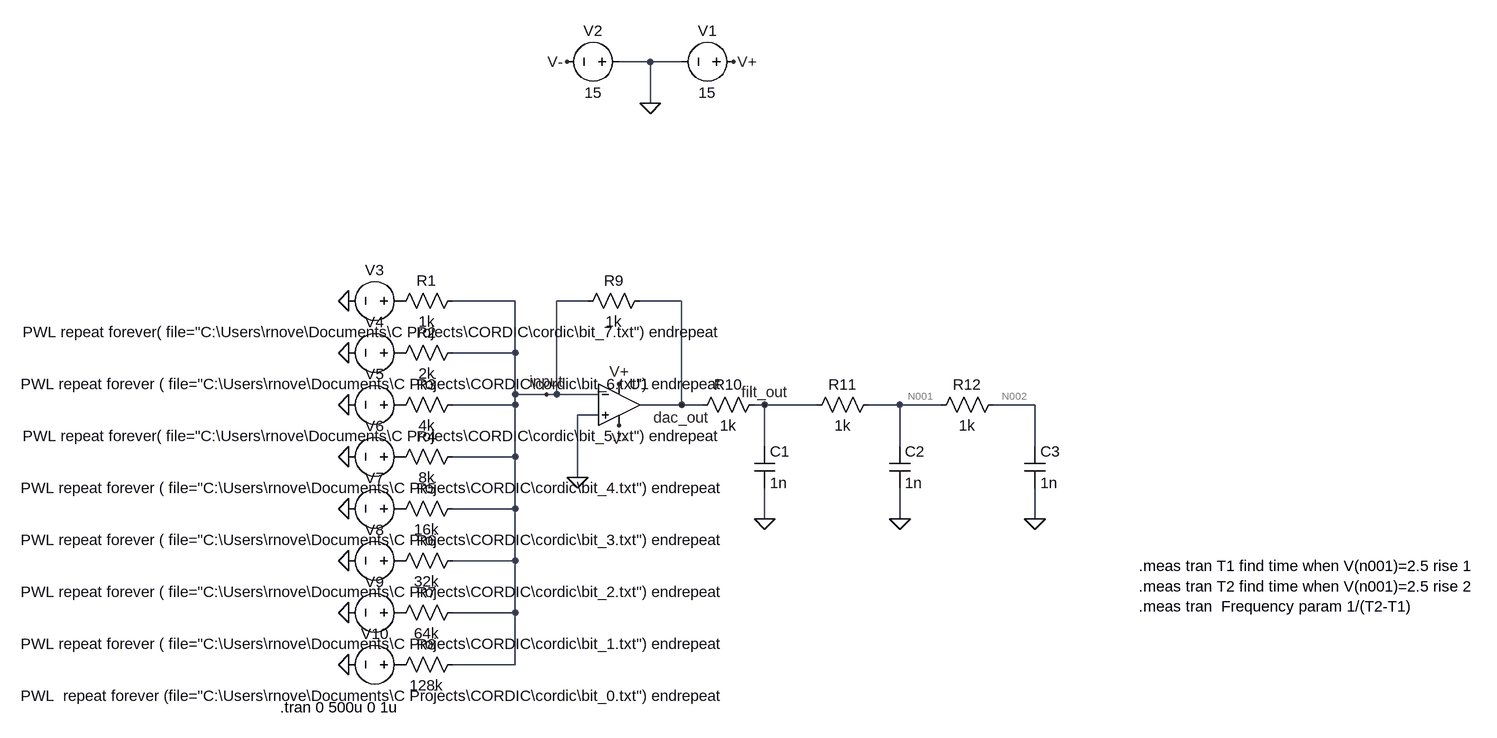
[diagram p0: schematic cordic_dac.asc]
cordic_dac.asc, the LTspice schematic file:
Version 4
SHEET 1 1596 680
WIRE 272 -352 224 -352
WIRE 320 -352 272 -352
WIRE 272 -288 272 -352
WIRE 64 16 -32 16
WIRE 176 16 128 16
WIRE 320 16 256 16
WIRE 64 96 64 16
WIRE 64 96 -32 96
WIRE 64 160 64 96
WIRE 112 160 64 160
WIRE 128 160 128 16
WIRE 128 160 112 160
WIRE 192 160 128 160
WIRE 64 176 64 160
WIRE 64 176 -32 176
WIRE 320 176 320 16
WIRE 320 176 256 176
WIRE 352 176 320 176
WIRE 448 176 432 176
WIRE 528 176 448 176
WIRE 656 176 608 176
WIRE 720 176 656 176
WIRE 864 176 800 176
WIRE 192 192 160 192
WIRE 448 240 448 176
WIRE 656 240 656 176
WIRE 864 240 864 176
WIRE 64 256 64 176
WIRE 64 256 -32 256
WIRE 160 288 160 192
WIRE 64 336 64 256
WIRE 64 336 -32 336
WIRE 448 352 448 304
WIRE 656 352 656 304
WIRE 864 352 864 304
WIRE 64 416 64 336
WIRE 64 416 -32 416
WIRE 64 496 64 416
WIRE 64 496 -32 496
WIRE 64 576 64 496
WIRE 64 576 -32 576
FLAG 224 144 V+
FLAG 224 208 V-
FLAG 160 288 0
FLAG 272 -288 0
FLAG 400 -352 V+
FLAG 144 -352 V-
FLAG 448 352 0
FLAG -192 576 0
FLAG -192 496 0
FLAG -192 416 0
FLAG -192 336 0
FLAG -192 256 0
FLAG -192 176 0
FLAG -192 96 0
FLAG -192 16 0
FLAG 112 160 input
FLAG 320 176 dac_out
FLAG 448 176 filt_out
FLAG 656 352 0
FLAG 864 352 0
SYMBOL OpAmps\\UniversalOpAmp2 224 176 R0
SYMATTR InstName U1
SYMATTR SpiceLine Ilimit=25m Rail=50 Vos=0
SYMBOL res -16 0 R90
WINDOW 0 0 56 VBottom 2
WINDOW 3 32 56 VTop 2
SYMATTR InstName R1
SYMATTR Value 1k
SYMBOL res -16 80 R90
WINDOW 0 0 56 VBottom 2
WINDOW 3 32 56 VTop 2
SYMATTR InstName R2
SYMATTR Value 2k
SYMBOL res -16 160 R90
WINDOW 0 0 56 VBottom 2
WINDOW 3 32 56 VTop 2
SYMATTR InstName R3
SYMATTR Value 4k
SYMBOL res -16 240 R90
WINDOW 0 0 56 VBottom 2
WINDOW 3 32 56 VTop 2
SYMATTR InstName R4
SYMATTR Value 8k
SYMBOL res -16 320 R90
WINDOW 0 0 56 VBottom 2
WINDOW 3 32 56 VTop 2
SYMATTR InstName R5
SYMATTR Value 16k
SYMBOL res -16 400 R90
WINDOW 0 0 56 VBottom 2
WINDOW 3 32 56 VTop 2
SYMATTR InstName R6
SYMATTR Value 32k
SYMBOL res -16 480 R90
WINDOW 0 0 56 VBottom 2
WINDOW 3 32 56 VTop 2
SYMATTR InstName R7
SYMATTR Value 64k
SYMBOL res -16 560 R90
WINDOW 0 0 56 VBottom 2
WINDOW 3 32 56 VTop 2
SYMATTR InstName R8
SYMATTR Value 128k
SYMBOL voltage 416 -352 R90
WINDOW 0 -32 56 VBottom 2
WINDOW 3 32 56 VTop 2
WINDOW 123 0 0 Left 0
WINDOW 39 0 0 Left 0
SYMATTR InstName V1
SYMATTR Value 15
SYMBOL voltage 240 -352 R90
WINDOW 0 -32 56 VBottom 2
WINDOW 3 32 56 VTop 2
WINDOW 123 0 0 Left 0
WINDOW 39 0 0 Left 0
SYMATTR InstName V2
SYMATTR Value 15
SYMBOL res 272 0 R90
WINDOW 0 0 56 VBottom 2
WINDOW 3 32 56 VTop 2
SYMATTR InstName R9
SYMATTR Value 1k
SYMBOL cap 432 240 R0
SYMATTR InstName C1
SYMATTR Value 1n
SYMBOL res 448 160 R90
WINDOW 0 0 56 VBottom 2
WINDOW 3 32 56 VTop 2
SYMATTR InstName R10
SYMATTR Value 1k
SYMBOL voltage -96 16 R90
WINDOW 0 -32 56 VBottom 2
WINDOW 3 32 56 VTop 2
WINDOW 123 0 0 Left 0
WINDOW 39 0 0 Left 0
SYMATTR InstName V3
SYMATTR Value PWL repeat forever( file="C:\Users\rnove\Documents\C Projects\CORDIC\cordic\bit_7.txt") endrepeat
SYMBOL voltage -96 96 R90
WINDOW 0 -32 56 VBottom 2
WINDOW 3 32 56 VTop 2
WINDOW 123 0 0 Left 0
WINDOW 39 0 0 Left 0
SYMATTR InstName V4
SYMATTR Value PWL repeat forever ( file="C:\Users\rnove\Documents\C Projects\CORDIC\cordic\bit_6.txt") endrepeat
SYMBOL voltage -96 176 R90
WINDOW 0 -32 56 VBottom 2
WINDOW 3 32 56 VTop 2
WINDOW 123 0 0 Left 0
WINDOW 39 0 0 Left 0
SYMATTR InstName V5
SYMATTR Value PWL repeat forever( file="C:\Users\rnove\Documents\C Projects\CORDIC\cordic\bit_5.txt") endrepeat
SYMBOL voltage -96 256 R90
WINDOW 0 -32 56 VBottom 2
WINDOW 3 32 56 VTop 2
WINDOW 123 0 0 Left 0
WINDOW 39 0 0 Left 0
SYMATTR InstName V6
SYMATTR Value PWL repeat forever ( file="C:\Users\rnove\Documents\C Projects\CORDIC\cordic\bit_4.txt") endrepeat
SYMBOL voltage -96 336 R90
WINDOW 0 -32 56 VBottom 2
WINDOW 3 32 56 VTop 2
WINDOW 123 0 0 Left 0
WINDOW 39 0 0 Left 0
SYMATTR InstName V7
SYMATTR Value PWL repeat forever ( file="C:\Users\rnove\Documents\C Projects\CORDIC\cordic\bit_3.txt") endrepeat
SYMBOL voltage -96 416 R90
WINDOW 0 -32 56 VBottom 2
WINDOW 3 32 56 VTop 2
WINDOW 123 0 0 Left 0
WINDOW 39 0 0 Left 0
SYMATTR InstName V8
SYMATTR Value PWL repeat forever ( file="C:\Users\rnove\Documents\C Projects\CORDIC\cordic\bit_2.txt") endrepeat
SYMBOL voltage -96 496 R90
WINDOW 0 -32 56 VBottom 2
WINDOW 3 32 56 VTop 2
WINDOW 123 0 0 Left 0
WINDOW 39 0 0 Left 0
SYMATTR InstName V9
SYMATTR Value PWL repeat forever ( file="C:\Users\rnove\Documents\C Projects\CORDIC\cordic\bit_1.txt") endrepeat
SYMBOL voltage -96 576 R90
WINDOW 0 -32 56 VBottom 2
WINDOW 3 32 56 VTop 2
WINDOW 123 0 0 Left 0
WINDOW 39 0 0 Left 0
SYMATTR InstName V10
SYMATTR Value PWL  repeat forever (file="C:\Users\rnove\Documents\C Projects\CORDIC\cordic\bit_0.txt") endrepeat
SYMBOL res 624 160 R90
WINDOW 0 0 56 VBottom 2
WINDOW 3 32 56 VTop 2
SYMATTR InstName R11
SYMATTR Value 1k
SYMBOL cap 640 240 R0
SYMATTR InstName C2
SYMATTR Value 1n
SYMBOL res 816 160 R90
WINDOW 0 0 56 VBottom 2
WINDOW 3 32 56 VTop 2
SYMATTR InstName R12
SYMATTR Value 1k
SYMBOL cap 848 240 R0
SYMATTR InstName C3
SYMATTR Value 1n
TEXT -298 642 Left 2 !.tran 0 500u 0 1u
TEXT 1024 424 Left 2 !.meas tran T1 find time when V(n001)=2.5 rise 1\n.meas tran T2 find time when V(n001)=2.5 rise 2\n.meas tran  Frequency param 1/(T2-T1)

The netlist it stands for:
* cordic_dac.asc
XU1 0 input V+ V- dac_out level2 Avol=1Meg GBW=10Meg Slew=10Meg Ilimit=25m Rail=50 Vos=0 En=0 Enk=0 In=0 Ink=0 Rin=500Meg  ; pins In+ In- V+ V- OUT
R1 input P001 1k
R2 input P002 2k
R3 input P003 4k
R4 input P004 8k
R5 input P005 16k
R6 input P006 32k
R7 input P007 64k
R8 input P008 128k
V1 V+ 0 15
V2 0 V- 15
R9 dac_out input 1k
C1 filt_out 0 1n
R10 filt_out dac_out 1k
V3 P001 0 PWL repeat forever( file="C:\Users\rnove\Documents\C Projects\CORDIC\cordic\bit_7.txt") endrepeat
V4 P002 0 PWL repeat forever ( file="C:\Users\rnove\Documents\C Projects\CORDIC\cordic\bit_6.txt") endrepeat
V5 P003 0 PWL repeat forever( file="C:\Users\rnove\Documents\C Projects\CORDIC\cordic\bit_5.txt") endrepeat
V6 P004 0 PWL repeat forever ( file="C:\Users\rnove\Documents\C Projects\CORDIC\cordic\bit_4.txt") endrepeat
V7 P005 0 PWL repeat forever ( file="C:\Users\rnove\Documents\C Projects\CORDIC\cordic\bit_3.txt") endrepeat
V8 P006 0 PWL repeat forever ( file="C:\Users\rnove\Documents\C Projects\CORDIC\cordic\bit_2.txt") endrepeat
V9 P007 0 PWL repeat forever ( file="C:\Users\rnove\Documents\C Projects\CORDIC\cordic\bit_1.txt") endrepeat
V10 P008 0 PWL  repeat forever (file="C:\Users\rnove\Documents\C Projects\CORDIC\cordic\bit_0.txt") endrepeat
R11 N001 filt_out 1k
C2 N001 0 1n
R12 N002 N001 1k
C3 N002 0 1n
.tran 0 500u 0 1u
.meas tran T1 find time when V(n001)=2.5 rise 1
.meas tran T2 find time when V(n001)=2.5 rise 2
.meas tran  Frequency param 1/(T2-T1)
.lib UniversalOpAmp2.lib
.backanno
.end

* Results of the author's LTspice run, read from the files saved beside the schematic
* Operating Point, zero values left out:
*   V(dac_out) = 2.49 V
*   V(v+) = 15 V
*   V(v-) = -15 V
*   V(input) = 2.49 V
*   V(p002) = 5 V
*   V(p003) = 5 V
*   V(p004) = 5 V
*   V(p005) = 5 V
*   V(p006) = 5 V
*   V(p007) = 5 V
*   V(p008) = 5 V
*   V(filt_out) = 2.49 V
*   V(n001) = 2.49 V
*   V(n002) = 2.49 V
*   I(R1) = 2.49 mA
*   I(R2) = -1.255 mA
*   I(R3) = -627.5 µA
*   I(R4) = -313.7 µA
*   I(R5) = -156.9 µA
*   I(R6) = -78.43 µA
*   I(R7) = -39.22 µA
*   I(R8) = -19.61 µA
*   I(R9) = -9.966 pA
*   I(V1) = -240.2 nA
*   I(V2) = 30.14 nA
*   I(V3) = 2.49 mA
*   I(V4) = -1.255 mA
*   I(V5) = -627.5 µA
*   I(V6) = -313.7 µA
*   I(V7) = -156.9 µA
*   I(V8) = -78.43 µA
*   I(V9) = -39.22 µA
*   I(V10) = -19.61 µA
*   Ix(u1:2) = 4.98 nA
*   Ix(u1:3) = 240.2 nA
*   Ix(u1:4) = 30.14 nA
*   Ix(u1:5) = 9.966 pA
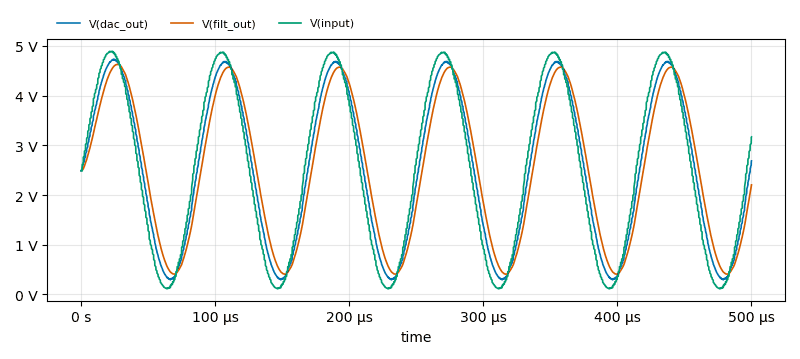
[diagram p1: Transient Analysis of cordic_dac.asc, plotted from the saved traces]
* Transient Analysis, 1 run:
*   V(dac_out): min 294.5 mV, max 4.733 V, average 2.505 V, rms 2.945 V, last 2.687 V
*   V(filt_out): min 408 mV, max 4.63 V, average 2.509 V, rms 2.909 V, last 2.205 V
*   V(input): min 113.6 mV, max 4.894 V, average 2.502 V, rms 3.016 V, last 3.17 V
* From the log:
*   t1: time=1.66357e-06 at 1.66357e-06
*   t2: time=9.15016e-05 at 9.15016e-05
*   frequency: 1/(t2-t1)=11131.1